# Altium schematic sheet PAGE17.SchDoc
size 246 x 182 mm
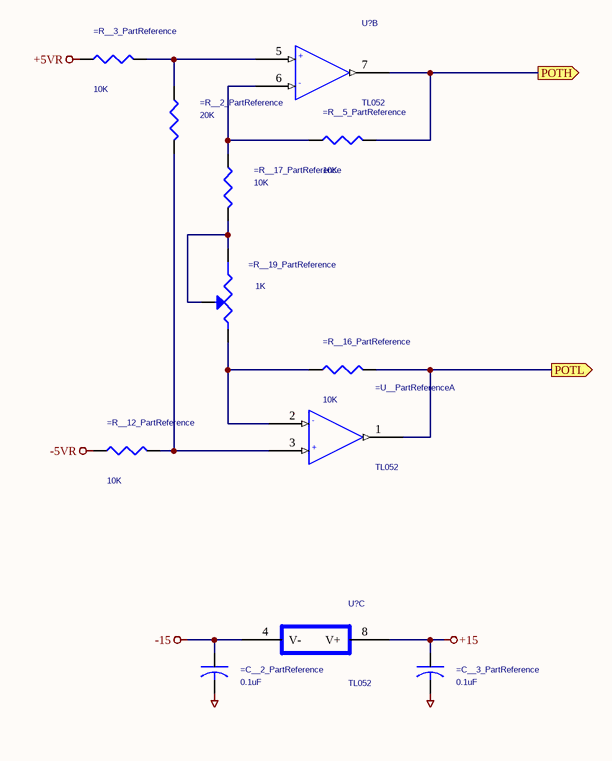
[diagram p0: PAGE17.SchDoc]

## Parts
(Parts that share a designator on the sheet are numbered #1, #2 ... from top to bottom, then left to right.)
=C__2_PartReference  0.1uF  [AXIALCAP0.3]
=C__3_PartReference  0.1uF  [AXIALCAP0.3]
=R__2_PartReference  20K  [AXIAL0.4]
=R__3_PartReference  10K  [AXIAL0.4]
=R__5_PartReference  10K  [AXIAL0.4]
=R__12_PartReference  10K  [AXIAL0.4]
=R__16_PartReference  10K  [AXIAL0.4]
=R__17_PartReference  10K  [AXIAL0.4]
=R__19_PartReference  1K  [TRIMPOT-3006]
=U__PartReference  TL052  [DIP8]  (part A of 3)
U?#1  TL052  [DIP8]  (part B of 3)
U?#2  TL052  [DIP8]  (part C of 3)

## Ports
POTH (out), POTL (out)

## Nets
+5VR: =R__3_PartReference.1
+15: =C__3_PartReference.1 U?#2.8(V+)
-5VR: =R__12_PartReference.1
-15: =C__2_PartReference.1 U?#2.4(V-)
AGND: =C__2_PartReference.2 =C__3_PartReference.2
POTH: =R__5_PartReference.2 U?#1.7(OUT) ; port POTH
POTL: =R__16_PartReference.2 =U__PartReference.1(OUT) ; port POTL
Net=R__2_PartReference_1: =R__2_PartReference.1 =R__3_PartReference.2 U?#1.5(+)
Net=R__2_PartReference_2: =R__2_PartReference.2 =R__12_PartReference.2 =U__PartReference.3(+)
Net=R__5_PartReference_1: =R__5_PartReference.1 =R__17_PartReference.1 U?#1.6(-)
Net=R__16_PartReference_1: =R__16_PartReference.1 =R__19_PartReference.A =U__PartReference.2(-)
Net=R__17_PartReference_2: =R__17_PartReference.2 =R__19_PartReference.B =R__19_PartReference.WIPER

## Library data of the parts
=C__2_PartReference =C__3_PartReference = CAP_Dup1
=R__2_PartReference =R__3_PartReference =R__5_PartReference =R__12_PartReference =R__16_PartReference =R__17_PartReference = R_Dup1
=R__19_PartReference = POT
=U__PartReference U?#1 U?#2 = GEN DUAL OPAMP-H
  =U__PartReference: PACKAGE: =U__PACKAGE
  U?#1 U?#2: PACKAGE: POTSCALE